# EAGLE design vaporsound (EAGLE 7.2.0)
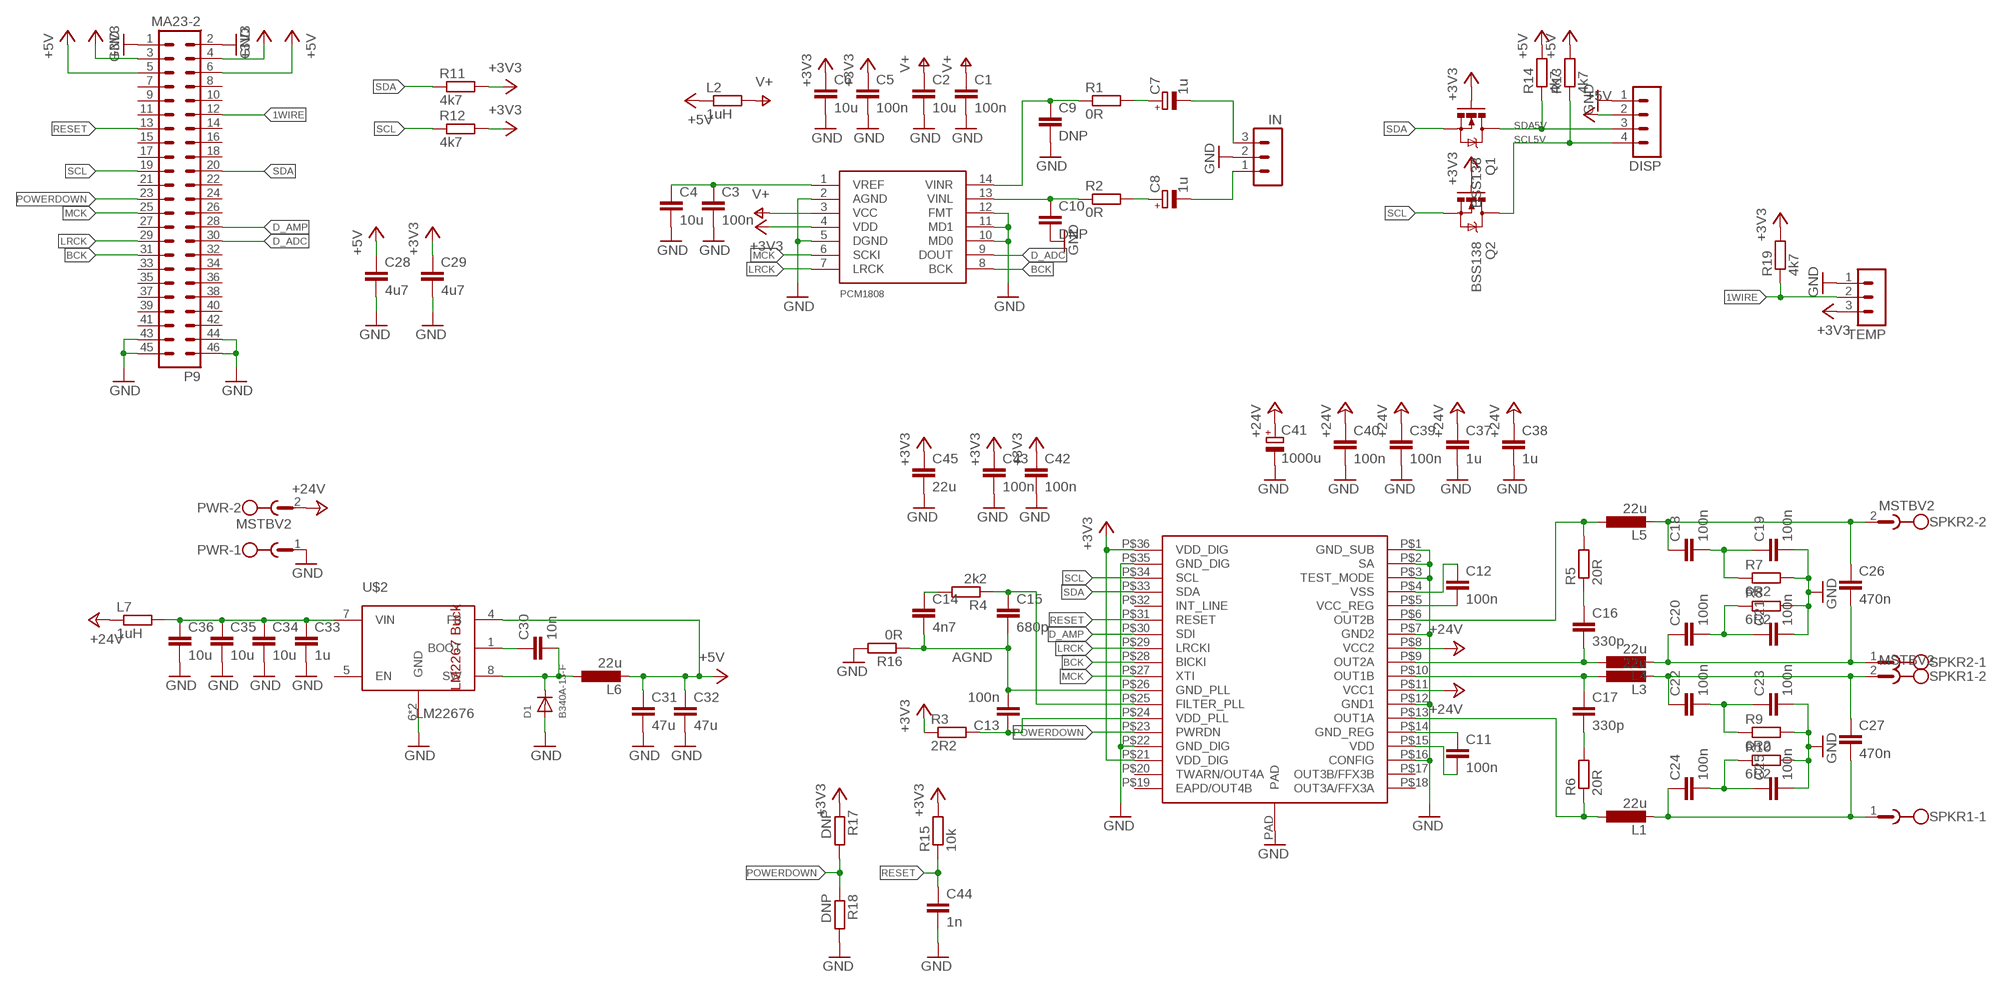
[diagram p0: schematic, sheet 1]

## Parts
C1  100n  C-EUC0603  [C0603]
C2  10u  C-EUC0805  [C0805]
C3  100n  C-EUC0603  [C0603]
C4  10u  C-EUC0805  [C0805]
C5  100n  C-EUC0603  [C0603]
C6  10u  C-EUC0805  [C0805]
C7  1u  CPOL-EUE2-5  [E2-5]
C8  1u  CPOL-EUE2-5  [E2-5]
C9  DNP  C-EUC0603  [C0603]
C10  DNP  C-EUC0603  [C0603]
C11  100n  C-EUC0603  [C0603]
C12  100n  C-EUC0603  [C0603]
C13  100n  C-EUC0603  [C0603]
C14  4n7  C-EUC0603  [C0603]
C15  680p  C-EUC0603  [C0603]
C16  330p  C-EUC0603  [C0603]
C17  330p  C-EUC0603  [C0603]
C18  100n  C-EUC0603  [C0603]
C19  100n  C-EUC0603  [C0603]
C20  100n  C-EUC0603  [C0603]
C21  100n  C-EUC0603  [C0603]
C22  100n  C-EUC0603  [C0603]
C23  100n  C-EUC0603  [C0603]
C24  100n  C-EUC0603  [C0603]
C25  100n  C-EUC0603  [C0603]
C26  470n  C-EU050-045X075  [C050-045X075]
C27  470n  C-EU050-045X075  [C050-045X075]
C28  4u7  C-EUC0805  [C0805]
C29  4u7  C-EUC0805  [C0805]
C30  10n  C-EUC0603  [C0603]
C31  47u  C-EUC1206  [C1206]
C32  47u  C-EUC1206  [C1206]
C33  1u  C-EUC0805  [C0805]
C34  10u  C-EUC1206  [C1206]
C35  10u  C-EUC1206  [C1206]
C36  10u  C-EUC1206  [C1206]
C37  1u  C-EUC1206  [C1206]
C38  1u  C-EUC1206  [C1206]
C39  100n  C-EUC0603  [C0603]
C40  100n  C-EUC0603  [C0603]
C41  1000u  CPOL-EUE5-10.5  [E5-10,5]
C42  100n  C-EUC0603  [C0603]
C43  100n  C-EUC0603  [C0603]
C44  1n  C-EUC0603  [C0603]
C45  22u  C-EUC1206  [C1206]
D1  B340A-13-F  DIODESMA  [SMADIODE]
DISP  MA04-1  [MA04-1]
IN  MA03-1  [MA03-1]
L1  22u  L-EUSRR1210  [SRR1210]
L2  1uH  R-EU_R0805  [R0805]
L3  22u  L-EUSRR1210  [SRR1210]
L4  22u  L-EUSRR1210  [SRR1210]
L5  22u  L-EUSRR1210  [SRR1210]
L6  22u  L-EUIHLP-3232DZ-11  [IHLP-3232DZ-11]
L7  1uH  R-EU_R0805  [R0805]
P9  MA23-2  [MA23-2]
PWR  MSTBV2  [MSTBV2]
Q1  BSS138  MOSFET-NCHANNELBSS138  [SOT23-3]
Q2  BSS138  MOSFET-NCHANNELBSS138  [SOT23-3]
R1  0R  R-EU_R0603  [R0603]
R2  0R  R-EU_R0603  [R0603]
R3  2R2  R-EU_R0603  [R0603]
R4  2k2  R-EU_R0603  [R0603]
R5  20R  R-EU_R1206  [R1206]
R6  20R  R-EU_R1206  [R1206]
R7  6R2  R-EU_R1206  [R1206]
R8  6R2  R-EU_R1206  [R1206]
R9  6R2  R-EU_R1206  [R1206]
R10  6R2  R-EU_R1206  [R1206]
R11  4k7  R-EU_R0603  [R0603]
R12  4k7  R-EU_R0603  [R0603]
R13  4k7  R-EU_R0603  [R0603]
R14  4k7  R-EU_R0603  [R0603]
R15  10k  R-EU_R0603  [R0603]
R16  0R  R-EU_R0603  [R0603]
R17  DNP  R-EU_R0603  [R0603]
R18  DNP  R-EU_R0603  [R0603]
R19  4k7  R-EU_R0603  [R0603]
SPKR1  MSTBV2  [MSTBV2]
SPKR2  MSTBV2  [MSTBV2]
TEMP  MA03-1  [MA03-1]
U$1  STA350BW  [POWERSSO-36]
U$2  LM22676  LM2267_123  [DDA0008B]
U$3  PCM1808  [TSSOP14]

## Nets
1WIRE: P9.12 R19.1 TEMP.2
24V_DIGITAL: C33.1 C34.1 C35.1 C36.1 L7.2 U$2.7(VIN)
+3V3: C5.1 C6.1 C29.1 C42.1 C43.1 C45.1 P9.3 P9.4 Q1.1(G) Q2.1(G) R3.1 R11.2 R12.2 R15.2 R17.1 R19.2 TEMP.3 U$1.P$21(VDD_DIG) U$1.P$36(VDD_DIG) U$3.4(VDD)
+5V: C28.1 C31.1 C32.1 DISP.2 L2.1 L6.P$2 P9.5 P9.6 R13.2 R14.2 U$2.4(FB)
+24V: C37.1 C38.1 C39.1 C40.1 C41.+ L7.1 PWR.2 U$1.P$8(VCC2) U$1.P$11(VCC1)
ADC_VREF: C3.1 C4.1 U$3.1(VREF)
AGND: C13.2 C14.2 C15.2 R16.1 U$1.P$26(GND_PLL)
BCK: P9.31 U$1.P$28(BICKI) U$3.8(BCK)
BOOST: C30.1 U$2.1(BOOT)
C_LEFT: C8.+ R2.2
C_RIGHT: C7.+ R1.2
D_ADC: P9.30 U$3.9(DOUT)
D_AMP: P9.28 U$1.P$30(SDI)
FILTER_PLL: C15.1 R4.1 U$1.P$25(FILTER_PLL)
GND: C1.2 C2.2 C3.2 C4.2 C5.2 C6.2 C9.2 C10.2 C19.2 C21.2 C23.2 C25.2 C28.2 C29.2 C31.2 C32.2 C33.2 C34.2 C35.2 C36.2 C37.2 C38.2 C39.2 C40.2 C41.- C42.2 C43.2 C44.2 C45.2 D1.A DISP.1 IN.2 P9.1 P9.2 P9.43 P9.44 P9.45 P9.46 PWR.1 R7.2 R8.2 R9.2 R10.2 R16.2 R18.2 TEMP.1 U$1.P$1(GND_SUB) U$1.P$2(SA) U$1.P$3(TEST_MODE) U$1.P$7(GND2) U$1.P$12(GND1) U$1.P$16(CONFIG) U$1.P$22(GND_DIG) U$1.P$35(GND_DIG) U$1.PAD U$2.6(GND) U$2.EPAD(GND) U$3.2(AGND) U$3.5(DGND) U$3.10(MD0) U$3.11(MD1) U$3.12(FMT)
GND_REG: C11.1 U$1.P$14(GND_REG)
LEFT_INPUT: C8.- IN.1
LRCK: P9.29 U$1.P$29(LRCKI) U$3.7(LRCK)
MCK: P9.25 U$1.P$27(XTI) U$3.6(SCKI)
N$6: C17.2 R6.2
N$11: C14.1 R4.2
N$12: C16.1 R5.1
N$19: C18.2 C19.1 R7.1
N$21: C20.2 C21.1 R8.1
N$27: C24.2 C25.1 R10.1
N$28: C22.2 C23.1 R9.1
OUT1A: L1.P$1 R6.1 U$1.P$13(OUT1A)
OUT1B: C17.1 L3.P$1 U$1.P$10(OUT1B)
OUT2A: C16.2 L4.P$1 U$1.P$9(OUT2A)
OUT2B: L5.P$1 R5.2 U$1.P$6(OUT2B)
POWERDOWN: P9.23 R17.2 R18.1 U$1.P$23(PWRDN)
RESET: C44.1 P9.13 R15.1 U$1.P$31(RESET)
RIGHT_INPUT: C7.- IN.3
SCL: P9.19 Q2.2(S) R12.1 U$1.P$34(SCL)
SCL5V: DISP.4 Q2.3(D) R13.1
SDA: P9.20 Q1.2(S) R11.1 U$1.P$33(SDA)
SDA5V: DISP.3 Q1.3(D) R14.1
SPKR1A: C24.1 C27.2 L1.P$2 SPKR1.1
SPKR1B: C22.1 C27.1 L3.P$2 SPKR1.2
SPKR2A: C20.1 C26.2 L4.P$2 SPKR2.1
SPKR2B: C18.1 C26.1 L5.P$2 SPKR2.2
SW: C30.2 D1.C L6.P$1 U$2.8(SW)
V+: C1.1 C2.1 L2.2 U$3.3(VCC)
VCC_REG: C12.2 U$1.P$5(VCC_REG)
VDD: C11.2 U$1.P$15(VDD)
VDD_PLL: C13.1 R3.2 U$1.P$24(VDD_PLL)
VIN_L: C10.1 R2.1 U$3.13(VINL)
VIN_R: C9.1 R1.1 U$3.14(VINR)
VSS: C12.1 U$1.P$4(VSS)
Unconnected: P9.7 P9.8 P9.9 P9.10 P9.11 P9.14 P9.15 P9.16 P9.17 P9.18 P9.21 P9.22 P9.24 P9.26 P9.27 P9.32 P9.33 P9.34 P9.35 P9.36 P9.37 P9.38 P9.39 P9.40 P9.41 P9.42 U$1.P$17(OUT3B/FFX3B) U$1.P$18(OUT3A/FFX3A) U$1.P$19(EAPD/OUT4B) U$1.P$20(TWARN/OUT4A) U$1.P$32(INT_LINE) U$2.5(EN)

## Library data of the parts
C1-C6 C9-C40 C42-C45 = rcl:C-EU: CAPACITOR, European symbol
C7 C8 C41 = rcl:CPOL-EU: POLARIZED CAPACITOR, European symbol
D1 = mircobuilder:DIODE: Diode SMA Model Volts Amps Type Vf Vr Digikey # Notes SSA34-E3 40V 3A Schottky 480mV @ 3A 200uA @ 40V SSA34-E3/61TGITR-ND CDBA120-G 20V 1A Schottky 500mV @ 1A 500uA @ 20V 641-1014-6-ND REEL MBRA210 10V 2A Schottky 350mV @ 2A 700uA @ 10V MBRA210LT3 SOD-123 Model Volts Amps Type Vf Vr Order # Notes BAT54T1G 30V 200mA Schottky 800mV @ 200mA 2uA @ 25V BAT54T1GOSTR-ND B0530W 30V 500mA Schottky 430mV @ 500mA 130uA @ 30V B0530W-FDICT-ND REEL MBR120 1A 20V Schottky 340mV @ 1A MBR120VLSFT1GOSCT-ND SOD-323 Model Volts Amps Type Vf Vr Order # Notes PMEG2005EJ 20V 500mA Schottky 355mV @ 500mA 568-4110-1-ND ZLLS410 10V 570mA Schottky 380mV @ 570mA ZLLS410CT-ND 1N4148WS 75V 150mA Silicon/Simple 1V 1N4148WSFSCT-ND REEL SOD-523 Model Volts Amps Type Vf Vr Order # Notes BAT54XV2 30V 200mA Schottky 0.8V @ 100mA BAT54XV2CT-ND TB751S 30V 30mA Schottky RB751S-40TE61CT-ND SOT23-R/W (R = Solder Paste/Reflow Ovens, W = Hand-Soldering) Model Volts Amps Type Vf Vr Order # Notes BAT54FILM 40V 300mA Schottky 497-7162-1-ND
DISP = con-lstb:MA04-1: PIN HEADER; OC_FARNELL: unknown; OC_NEWARK: unknown
IN TEMP = con-lstb:MA03-1: PIN HEADER; OC_FARNELL: unknown; OC_NEWARK: unknown
L1 L3-L6 = custom-ind:L-EU: INDUCTOR, European symbol
L2 L7 R1-R19 = rcl:R-EU_: RESISTOR, European symbol
P9 = con-lstb-mod:MA23-2
PWR SPKR1 SPKR2 = con-phoenix-508:MSTBV2: PHOENIX; MPN: MSTBV 2,5/2-GF-5.08; OC_FARNELL: 1792792; OC_NEWARK: 69R9845
Q1 Q2 = SparkFun-DiscreteSemi:MOSFET-NCHANNEL: Common NMOSFET Parts MFG P/N Store ID Prod ID FDD8780 TRANS-09984 SI7820DN TRANS-11055 FDS6630A IC-08089 2N7002PW TRANS-11151 FQP30N06L COM-10213 TRANS-10060 BSS123LT1G TRANS-08345 BSS138 TRANS-00830 BS170 2N7000; PROD_ID: TRANS-00830
U$1 = sta350bw:STA350BW
U$2 = LM2267_123:LM2267_123: LM2267x X may be either the 1, 2, or 3 versions.
U$3 = pcm1808:PCM1808

## Board
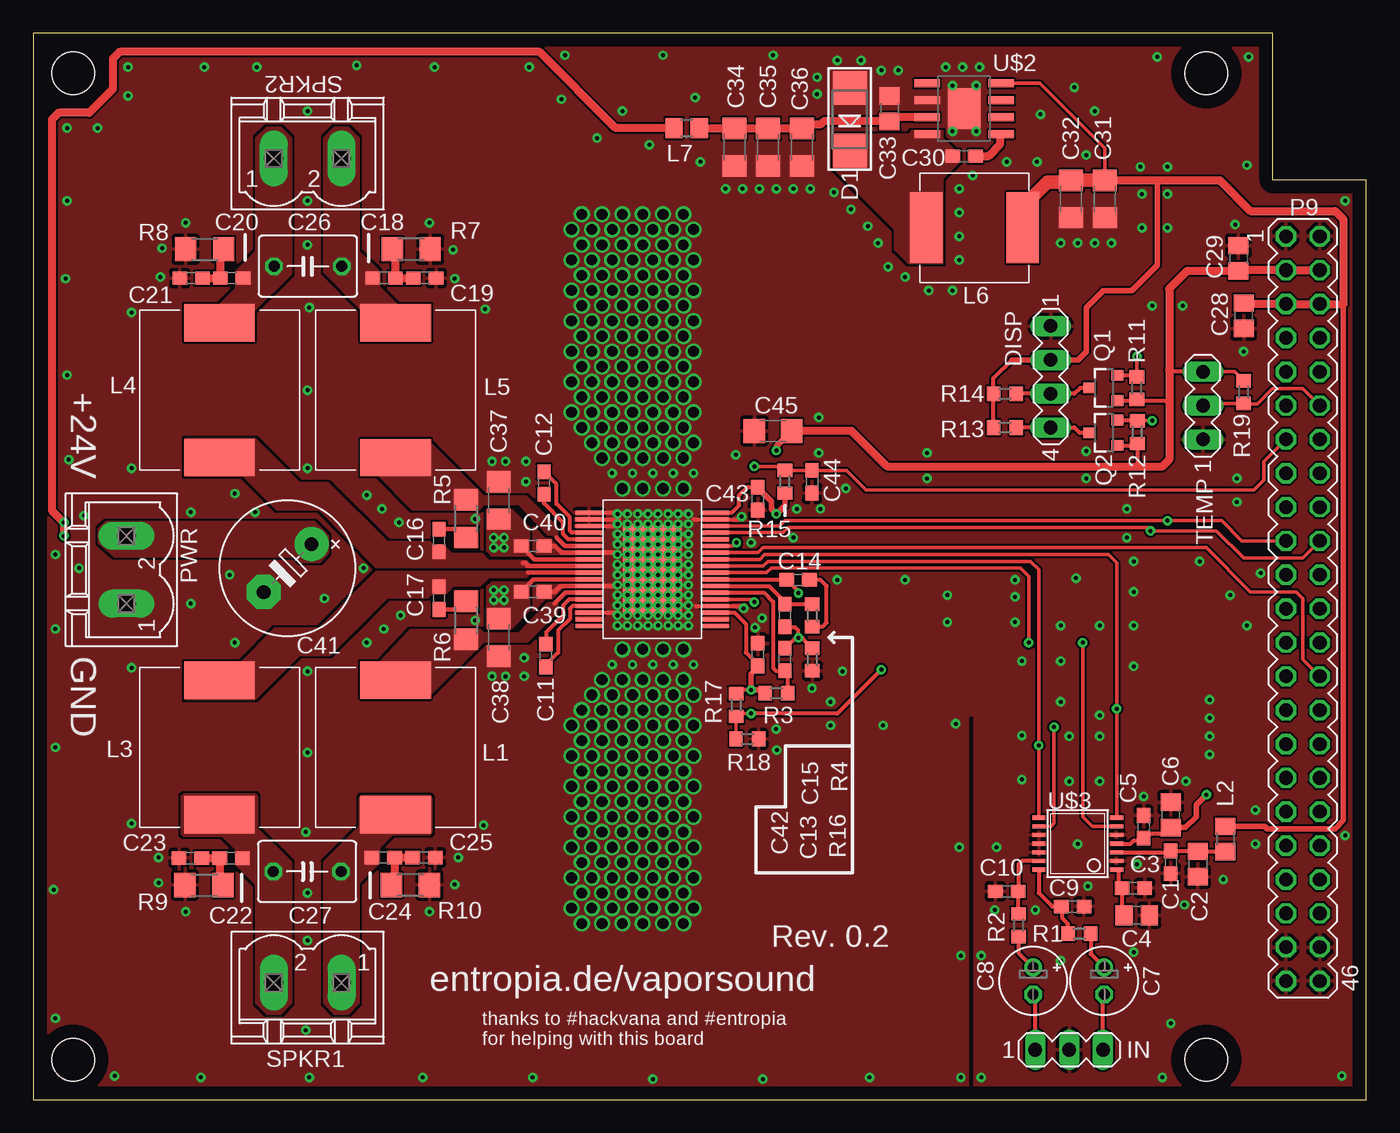
[diagram p1: board, top side]
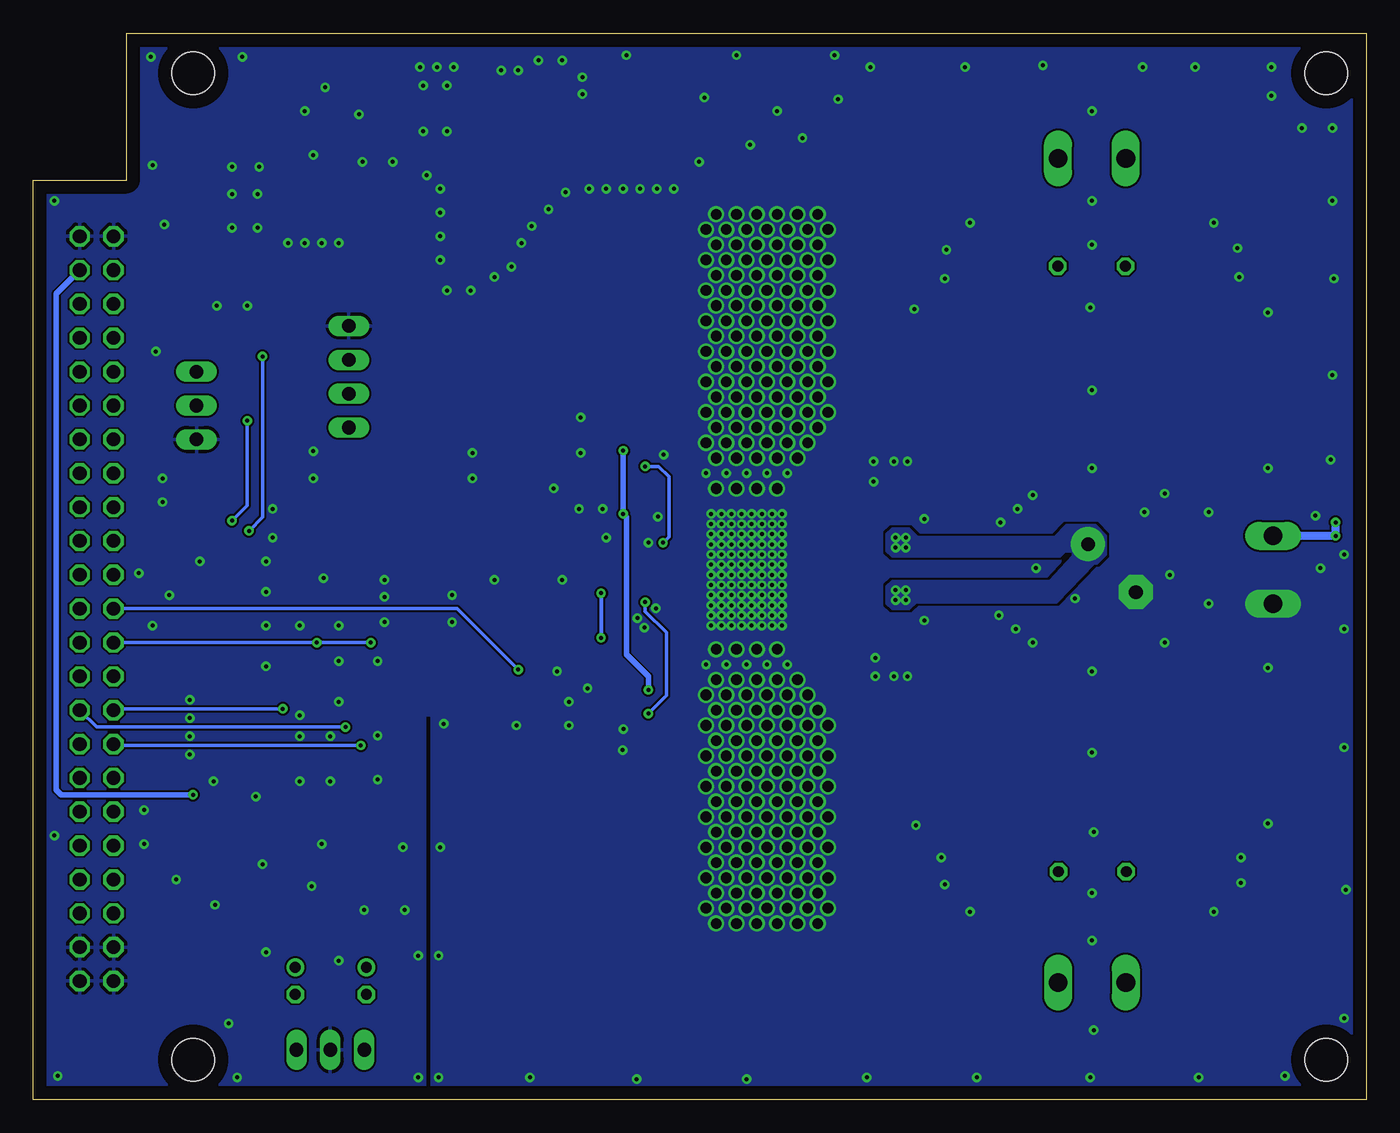
[diagram p2: board, bottom side, seen from below]

Size 100 x 80 mm. Coordinates in mm from the lower left corner, seen from the top.
Outline: 0,0 100,0 100,69 93,69 93,80 0,80 0,0
Copper layers (1*16): Top 0.035mm / dielectric 1.5mm / Bottom 0.035mm
Design rules "default *": minimum track width 8mil, minimum drill 0.3mm, track to track 6mil, track to pad 6mil, pad to pad 6mil, via to via 6mil, smd to smd 6mil, copper to edge 40mil, drill to drill 8mil, minimum pad ring 10mil, minimum via ring 8mil, stop-mask expansion 4mil, vias tented up to drill 0mil, thermal gap 10mil
Holes 3.2 mm at 3,77 3,3 88,3 88,77

### Footprints (pad centres in the part's own frame; a part is rotated, then mirrored left to right if it is on the bottom)
C0603 = smd 1.1 x 1: 1 -0.85,0; 2 0.85,0
C0805 = smd 1.3 x 1.5: 1 -0.95,0; 2 0.95,0
E2-5 = drill 0.813 pad 1.27: + -1.016,0 | drill 0.813 pad 1.27 octagon: - 1.016,0
C050-045X075 = drill 0.813 octagon: 1 -2.54,0; 2 2.54,0
C1206 = smd 1.6 x 1.8: 1 -1.4,0; 2 1.4,0
E5-10,5 = drill 1.016 pad 2.54: + -2.54,0 | drill 1.016 pad 2.54 octagon: - 2.54,0
SMADIODE = smd 2.54 x 2.54: A 2.349,0; C -2.349,0
MA04-1 = drill 1.016 long: 1 -3.81,0; 2 -1.27,0; 3 1.27,0; 4 3.81,0
MA03-1 = drill 1.016 long: 1 -2.54,0; 2 0,0; 3 2.54,0
SRR1210 = smd 5.3 x 2.8: P$1 0,5.05; P$2 0,-5.05
R0805 = smd 1.3 x 1.5: 1 -0.95,0; 2 0.95,0
IHLP-3232DZ-11 = smd 5.334 x 2.413: P$1 0,3.619; P$2 0,-3.619
MA23-2 = drill 1.016 octagon: 1 0,0; 2 0,2.54; 3 2.54,0; 4 2.54,2.54; 5 5.08,0; 6 5.08,2.54; 7 7.62,0; 8 7.62,2.54; 9 10.16,0; 10 10.16,2.54; 11 12.7,0; 12 12.7,2.54; 13 15.24,0; 14 15.24,2.54; 15 17.78,0; 16 17.78,2.54; 17 20.32,0; 18 20.32,2.54; 19 22.86,0; 20 22.86,2.54; 21 25.4,0; 22 25.4,2.54; 23 27.94,0; 24 27.94,2.54; 25 30.48,0; 26 30.48,2.54; 27 33.02,0; 28 33.02,2.54; 29 35.56,0; 30 35.56,2.54; 31 38.1,0; 32 38.1,2.54; 33 40.64,0; 34 40.64,2.54; 35 43.18,0; 36 43.18,2.54; 37 45.72,0; 38 45.72,2.54; 39 48.26,0; 40 48.26,2.54; 41 50.8,0; 42 50.8,2.54; 43 53.34,0; 44 53.34,2.54; 45 55.88,0; 46 55.88,2.54
MSTBV2 = drill 1.397 long: 1 -2.54,0; 2 2.54,0
SOT23-3 = smd 0.8 x 0.9: 1 -0.95,-1; 2 0.95,-1; 3 0,1.1
R0603 = smd 1 x 1.1: 1 -0.85,0; 2 0.85,0
R1206 = smd 1.6 x 1.803: 1 -1.422,0; 2 1.422,0
POWERSSO-36 = smd 2 x 0.318: P$1 -4.75,4.25; P$2 -4.75,3.75; P$3 -4.75,3.25; P$4 -4.75,2.75; P$5 -4.75,2.25; P$6 -4.75,1.75; P$7 -4.75,1.25; P$8 -4.75,0.75; P$9 -4.75,0.25; P$10 -4.75,-0.25; P$11 -4.75,-0.75; P$12 -4.75,-1.25; P$13 -4.75,-1.75; P$14 -4.75,-2.25; P$15 -4.75,-2.75; P$16 -4.75,-3.25; P$17 -4.75,-3.75; P$18 -4.75,-4.25; P$19 4.75,-4.25; P$20 4.75,-3.75; P$21 4.75,-3.25; P$22 4.75,-2.75; P$23 4.75,-2.25; P$24 4.75,-1.75; P$25 4.75,-1.25; P$26 4.75,-0.75; P$27 4.75,-0.25; P$28 4.75,0.25; P$29 4.75,0.75; P$30 4.75,1.25; P$31 4.75,1.75; P$32 4.75,2.25; P$33 4.75,2.75; P$34 4.75,3.25; P$35 4.75,3.75; P$36 4.75,4.25 | smd 4.4 x 6.8: PAD 0,0
DDA0008B = smd 1.91 x 0.61: 1 -2.78,1.905; 2 -2.78,0.635; 3 -2.78,-0.635; 4 -2.78,-1.905; 5 2.78,-1.905; 6 2.78,-0.635; 7 2.78,0.635; 8 2.78,1.905 | smd 2.41 x 3.1: EPAD 0,0
TSSOP14 = smd 0.305 x 0.991: 1 -1.95,-2.918; 2 -1.3,-2.918; 3 -0.65,-2.918; 4 0,-2.918; 5 0.65,-2.918; 6 1.3,-2.918; 7 1.95,-2.918; 8 1.95,2.918; 9 1.3,2.918; 10 0.65,2.918; 11 0,2.918; 12 -0.65,2.918; 13 -1.3,2.918; 14 -1.95,2.918

### Placement (x,y rotation side)
C1  85.34,17.8 270 top
C2  87.37,17.68 270 top
C3  82.53,15.87 0 top
C4  82.78,13.84 0 top
C5  83.3,20.47 90 top
C6  85.34,21.36 90 top
C7  80.35,8.9 270 top
C8  75.01,8.9 270 top
C9  77.98,14.48 0 top
C10  73.03,15.62 180 top
C11  38.44,33.3 270 top
C12  38.31,46.26 270 top
C13  56.39,33.02 90 top
C14  57.38,38.99 180 top
C15  56.39,36.32 270 top
C16  30.44,41.94 270 top
C17  30.44,37.62 270 top
C18  26.32,61.64 0 top
C19  29.37,61.64 0 top
C20  14.89,61.64 180 top
C21  11.84,61.64 180 top
C22  14.83,18.12 180 top
C23  11.78,18.12 180 top
C24  26.26,18.16 0 top
C25  29.31,18.16 0 top
C26  20.6,62.52 180 top
C27  20.55,17.1 0 top
C28  90.81,58.8 270 top
C29  90.42,63.12 90 top
C30  69.83,70.79 180 top
C31  80.39,67.56 270 top
C32  77.85,67.56 270 top
C33  64.25,74.34 90 top
C34  52.59,71.45 270 top
C35  55.13,71.45 270 top
C36  57.67,71.45 270 top
C37  34.92,44.96 90 top
C38  34.92,34.67 270 top
C39  37.47,38.1 0 top
C40  37.47,41.53 0 top
C41  19.08,39.87 225 top
C42  54.36,33.38 90 top
C43  54.36,45.09 270 top
C44  58.42,46.35 270 top
C45  55.5,50.16 180 top
D1  61.26,73.55 90 top
DISP  76.33,54.23 270 top
IN  77.72,3.73 0 top
L1  27.18,26.42 0 top
L2  89.43,19.55 270 top
L3  13.97,26.42 0 top
L4  13.97,53.21 180 top
L5  27.18,53.21 180 top
L6  70.61,65.41 90 top
L7  49.02,72.9 0 top
P9  93.98,64.77 270 top
PWR  6.99,39.75 90 top
Q1  80.33,53.4 90 top
Q2  80.33,50.03 90 top
R1  78.49,12.45 0 top
R2  73.91,13.08 270 top
R3  55.75,30.48 0 top
R4  58.45,36.32 270 top
R5  32.47,43.59 90 top
R6  32.47,35.97 90 top
R7  28.35,63.8 0 top
R8  12.86,63.8 180 top
R9  12.8,16.09 180 top
R10  28.29,16.09 0 top
R11  82.79,53.38 270 top
R12  82.83,50.08 270 top
R13  72.9,50.42 180 top
R14  72.9,52.96 180 top
R15  56.39,46.35 270 top
R16  58.45,33.02 270 top
R17  52.73,29.59 270 top
R18  53.57,27.05 0 top
R19  90.81,53.09 90 top
SPKR1  20.57,8.76 180 top
SPKR2  20.57,70.61 0 top
TEMP  87.76,52.07 90 top
U$1  46.44,39.78 0 top
U$2  69.83,74.34 180 top
U$3  78.35,19.2 90 top

### Tracks (layer width: path | path; a pad name or v marks a point on that pad's centre or on a via)
1WIRE
  Top 0.254: P9.12 95.25,53.34 92.96,53.34 91.82,52.2 90.84,52.2 R19.1 87.92,52.24 TEMP.2
24V_DIGITAL
  Top 0.61: U$2.7 64.56,73.71 C33.1 59.3,73.39 59.05,73.15 57.97,73.15 C36.1 C35.1 C34.1 52.55,72.9 L7.2
+3V3  (via drill 0.3)
  Top 0.254: TEMP.3 90.13,54.61 R19.2 | 85.08,52.45 85.1,52.45 85.22,52.32 | 52.77,30.73 52.73,30.73 R17.1
  Top 0.305: U$3.4 82.32,19.2 82.55,19.43 83.12,19.43 C5.1 83.62,19.94 84.71,19.94 84.84,20.07 84.96,20.07 85.31,20.41 C6.1 | Q2.1 82.68,49.08 R12.2 82.83,47.52 82.8,47.5 | Q1.1 82.71,52.45 | 82.71,52.45 R11.2 | U$1.P$36 52.41,44.03 52.96,44.58 52.96,45.34 53.59,45.97 54.32,45.97 C43.1 | v53.85,30.73 52.77,30.73 | U$1.P$21 52.62,36.53 53.47,35.69 53.47,33.53 54.36,32.64 C42.1 | 82.71,52.45 85.08,52.45 | TEMP.3 85.34,54.61 85.22,54.74
  Top 0.406: R15.2 56.39,44.58 v55.75,43.94 55.37,44.32 55.37,44.86 54.36,45.87 C43.1 | R3.1 54.65,30.73 v53.85,30.73 53.85,31.92 54.36,32.42 C42.1 | C6.1 86.45,20.41 87.25,21.21 87.25,22.1 v88.01,22.86 | v55.75,48.69 55.75,49.02 C45.1
  Top 0.61: P9.4 P9.3 90.48,62.23 C29.1 86.55,62.17 85.22,60.83 85.22,54.74 85.22,52.32 85.22,48.01 84.71,47.5 82.8,47.5 64.06,47.5 61.39,50.16 C45.1
  Bottom 0.406: v53.85,30.73 53.85,31.75 55.5,33.4 55.5,43.69 v55.75,43.94 v55.75,48.69 | v88.01,22.86 97.92,22.86 98.3,23.24 98.3,60.45 P9.4
+5V
  Top 0.254: U$2.4 75.52,76.25 80.39,71.37 C31.1
  Top 0.305: R13.2 R14.2 72.01,53 72.01,54.1 73.41,55.5
  Top 0.406: 84.33,68.96 84.33,62.61 82.42,60.71 80.26,60.71 78.99,59.44 78.99,56.13 78.36,55.5 DISP.2 73.41,55.5 | L2.1 92.4,20.5 92.58,20.32 97.66,20.32 98.3,20.95 98.3,60.07
  Top 0.61: C28.1 90.87,59.69 P9.5 P9.6 98.3,59.69 98.3,60.07 98.3,66.04 97.66,66.67 91.31,66.67 89.02,68.96 84.33,68.96 C31.1
  Top 0.813: 74.22,66.98 74.23,66.98 L6.P$2
  Top 1.016: 74.22,66.98 76.07,68.83 77.72,68.83 C32.1 C31.1
+24V  (via drill 0.3, 0.3 pad 0.3)
  Top 0.33: U$1.P$11 37.55,39.03 C39.1 | U$1.P$8 37.61,40.53 C40.1
  Top 0.61: L7.1 43.69,72.9 37.97,78.61 6.48,78.61 5.97,78.11 5.97,75.82 4.19,74.04 1.91,74.04 1.4,73.53 1.4,44.2 v2.29,43.31 v2.29,42.29
  Bottom 0.61: PWR.2 v2.29,42.29 v2.29,43.31
  other vias: 34.54,42.16 35.31,42.16 34.54,41.4 35.31,41.4 35.31,37.47 34.54,37.47 34.54,38.23 35.31,38.23
  pour Top (no thermals): 34.04,35.43 35.94,35.43 37.21,36.7 37.21,38.73 37.13,38.81 34.37,38.81 34.04,38.48
  pour Top (no thermals): 34.04,44.2 35.94,44.2 37.21,42.93 37.21,40.82 34.37,40.82 34.04,41.15
  pour Bottom (no thermals): 34.29,42.8 35.56,42.8 35.94,42.42 35.94,41.15 35.56,40.77 22.99,40.77 22.61,41.15 21.97,41.15 21.97,40.77 23.75,38.86 35.56,38.86 35.94,38.48 35.94,37.21 35.56,36.83 34.29,36.83 33.78,37.34 23.24,37.34 20.45,40.26 20.19,40.26 19.56,40.89 19.56,42.29 20.32,43.05 22.48,43.05 23.37,42.16 33.66,42.16
  pour Top (no thermals): 5.46,43.31 21.08,43.31 22.1,42.29 22.1,41.02 21.46,40.39 20.07,40.39 19.68,40.77 6.1,40.77 4.95,41.78 4.95,42.8
ADC_VREF
  Top 0.305: U$3.1 81.38,17.25 81.41,17.27 81.41,16.14 C3.1 81.68,13.99 C4.1
AGND  (via drill 0.3)
  Top 0.305: v57.4,34.65 57.4,35.18 57.15,35.43 56.43,35.43 C15.2 | v57.4,34.65 57.16,34.65 C13.2 | U$1.P$26 56.49,39.03 C14.2 57.4,38.11 v57.4,38 | v57.4,34.65 57.67,34.65 R16.1
  Bottom 0.305: v57.4,38 v57.4,34.65
BCK  (via drill 0.3)
  Top 0.254: U$1.P$28 54.76,40.03 55.12,40.39 74.8,40.39 75.44,39.75 v75.44,26.57 U$3.8
  Bottom 0.254: v75.44,26.57 93.88,26.57 P9.31
BOOST
  Top 0.61: U$2.1 72.52,72.44 72.52,71.63 71.67,70.79 C30.1
C_LEFT
  Top 0.305: R2.2 73.91,11.01 C8.+
C_RIGHT
  Top 0.305: R1.2 79.34,10.93 C7.+
D_ADC  (via drill 0.3)
  Top 0.254: U$3.9 76.38,20.5 76.58,20.7 v76.58,27.94
  Bottom 0.254: v76.58,27.94 95.25,27.94 P9.30
D_AMP
  Top 0.254: U$1.P$30 54.37,41.03 54.74,41.4 88.01,41.4 91.31,38.1 94.74,38.1 95.25,37.59 95.25,33.02 P9.28
FILTER_PLL
  Top 0.305: U$1.P$25 55.2,38.53 56.39,37.34 C15.1 R4.1
GND  (via drill 0.3, 0.8)
  Top 0.305: 43.68,41.03 43.69,41.02 | U$1.P$3 43.79,43.03 43.81,43.05 | U$1.P$2 43.91,43.53 43.94,43.56 | U$1.P$1 43.78,44.03 43.81,44.07 | 43.77,38.53 43.81,38.48 | U$1.P$16 43.64,36.53 43.69,36.58 | 39.12,41.53 39.62,41.03 | 53.01,37.03 U$1.P$22 49.71,37.03 | v53.14,43.74 52.93,43.53 U$1.P$35 49.56,43.53
  Top 0.33: 43.68,41.03 U$1.P$7 39.62,41.03 | 43.77,38.53 U$1.P$12 39.55,38.53 39.12,38.1
  Top 0.343: C39.2 39.12,38.1 | C40.2 39.12,41.53
  other vias: 58.29,68.33 57.02,68.33 54.48,68.33 51.94,68.33 63.63,77.22 64.9,77.22 68.45,77.47 78.99,70.87 77.09,64.26 78.36,64.26 79.63,64.26 80.9,64.26 53.21,68.33 55.75,68.33 69.47,68.33 70.48,69.34 75.56,73.91 69.72,77.47 62.1,77.98 60.33,77.98 58.8,76.71 58.8,75.44 78.11,75.95 79.63,74.17 70.99,77.47 68.96,76.07 70.74,76.07 68.96,72.64 70.74,72.64 60.07,68.07 62.61,65.53 63.37,64.26 67.18,60.71 69.47,66.55 69.47,62.99 61.34,66.8 64.14,62.48 65.41,61.72 69.47,64.77 75.31,70.36 73.03,70.36 68.96,60.71 33.15,43.56 33.15,35.94 27.56,36.32 27.43,43.31 25.02,34.29 25.02,45.34 16.64,44.07 21.84,37.59 34.42,47.88 35.43,47.88 34.42,31.75 35.43,31.75 36.96,46.35 36.83,33.15 46.1,40.13 46.1,39.37 46.86,40.13 46.86,39.37 47.62,40.13 48.39,40.13 49.15,40.13 45.34,40.13 44.58,40.13 43.81,40.13 43.81,40.89 43.81,41.66 43.81,42.42 43.81,43.18 43.81,43.94 44.58,43.94 45.34,43.94 43.81,39.37 43.81,38.61 43.81,37.85 43.81,37.08 43.81,36.32 43.81,35.56 44.58,35.56 45.34,35.56 46.1,35.56 46.86,35.56 47.62,35.56 48.39,35.56 49.15,35.56 49.15,36.32 49.15,37.08 49.15,37.85 49.15,38.61 49.15,39.37 44.58,39.37 45.34,39.37 47.62,39.37 48.39,39.37 46.1,43.94 46.86,43.94 47.62,43.94 48.39,43.94 49.15,43.94 49.15,43.18 49.15,42.42 49.15,41.66 49.15,40.89 48.39,40.89 48.39,41.66 48.39,42.42 48.39,43.18 47.62,43.18 46.86,43.18 46.1,43.18 45.34,43.18 44.58,43.18 44.58,42.42 45.34,42.42 46.1,42.42 46.86,42.42 47.62,42.42 44.58,41.66 44.58,40.89 44.58,38.61 44.58,37.85 44.58,37.08 44.58,36.32 45.34,36.32 46.1,36.32 46.86,36.32 47.62,36.32 48.39,36.32 48.39,37.08 48.39,37.85 48.39,38.61 45.34,40.89 46.1,40.89 46.86,40.89 47.62,40.89 47.62,41.66 46.86,41.66 46.1,41.66 45.34,41.66 45.34,38.61 46.1,38.61 46.86,38.61 47.62,38.61 47.62,37.85 47.62,37.08 45.34,37.85 45.34,37.08 46.1,37.08 46.86,37.08 46.86,37.85 46.1,37.85 31.62,61.59 31.5,63.75 29.72,65.79 11.43,65.79 9.65,63.88 9.53,61.72 9.4,18.16 9.4,16.26 11.43,14.1 29.72,14.1 31.62,16.13 31.88,18.16 15.11,45.47 15.11,34.29 11.81,37.21 24.77,39.88 20.7,59.44 20.45,20.07 20.57,32.13 20.57,47.37 7.11,77.47 4.83,72.9 2.54,72.9 30.1,77.47 37.21,77.47 50.04,70.36 42.29,72.14 20.57,74.17 39.88,78.36 24.26,77.6 16.76,77.47 12.83,77.47 2.54,67.44 2.41,61.59 2.67,48.01 11.81,44.07 20.57,26.04 20.57,53.21 47.24,78.36 91.19,78.23 84.33,78.23 91.06,70.1 98.17,1.78 84.71,1.65 6.1,1.78 1.65,6.1 1.65,35.31 1.65,26.42 1.52,15.75 12.57,1.65 20.7,1.65 29.21,1.65 37.47,1.65 46.48,1.52 54.74,1.52 62.74,1.65 71.12,1.65 49.66,75.18 46.23,71.63 55.5,78.36 39.62,75.06 44.2,74.17 2.54,54.36 3.81,43.81 3.43,39.88 1.65,40.89 69.6,1.65 71.12,10.79 77.09,10.41 82.55,11.05 72.26,18.92 78.36,19.18 86.36,14.61 54.15,35.41 53.29,36.86 54.69,36.12 89.28,16.51 83.31,22.73 58.42,30.86 53.85,41.78 57.02,42.16 83.19,67.94 85.09,67.94 83.19,65.41 85.09,65.41 83.06,69.98 85.09,69.98 90.17,65.66 90.81,56.13 98.42,67.44 98.42,19.81 91.69,21.72 91.69,19.18 92.08,39.5 87.5,40.39 89.79,37.85 91.06,35.56 82.55,35.56 82.04,42.16 57.28,44.32 59.05,44.32 82.04,44.32 90.3,44.83 80.01,28.83 77.09,29.84 77.09,32.89 82.55,40.39 58.93,48.51 78.99,46.61 90.3,46.61 82.55,32.51 65.41,38.99 74.17,27.3 77.72,23.88 86.49,23.88 55.78,26.21 63.75,28.07 60.71,32.13 74.17,32.89 73.66,38.99 78.23,39.12 82.55,38.1 80.01,35.56 77.09,35.56 80.01,23.88 88.27,28.63 88.27,27.25 80.01,27.25 77.72,27.25 74.17,24 52.7,48.39 79.12,16 72.14,14.22 82.8,17.65 75.18,14.22 85.34,5.71 7.11,75.31 20.45,5.21 69.6,10.79 69.47,18.92 69.22,28.19 60.33,38.99 68.58,35.81 68.58,37.85 73.66,37.72 73.66,35.81 59.82,29.84 59.82,28.07 88.27,25.88 88.27,30 58.93,51.18 78.99,48.64 20.57,67.44 20.57,11.94 60.96,45.85 67.06,48.51 67.06,46.61 44.2,45.85 45.72,45.85 47.24,45.85 48.77,45.85 44.2,33.78 45.72,33.78 47.24,33.78 48.77,33.78 44.96,46.99 46.48,46.99 48.01,46.99 49.53,46.99 43.43,46.99 44.96,32.64 46.48,32.64 48.01,32.64 49.53,32.64 43.43,32.64 48.77,31.5 47.24,31.5 45.72,31.5 44.2,31.5 44.2,48.13 48.77,48.13 47.24,48.13 45.72,48.13 44.96,49.28 46.48,49.28 48.01,49.28 49.53,49.28 43.43,49.28 44.2,50.42 48.77,50.42 47.24,50.42 45.72,50.42 44.96,30.35 46.48,30.35 48.01,30.35 49.53,30.35 43.43,30.35 48.77,29.21 47.24,29.21 45.72,29.21 44.2,29.21 55.73,27.79 44.96,28.07 46.48,28.07 48.01,28.07 49.53,28.07 43.43,28.07 48.77,26.92 47.24,26.92 45.72,26.92 44.2,26.92 44.96,25.78 46.48,25.78 48.01,25.78 49.53,25.78 43.43,25.78 48.77,24.64 47.24,24.64 45.72,24.64 44.2,24.64 44.96,51.56 46.48,51.56 48.01,51.56 49.53,51.56 43.43,51.56 44.2,52.7 48.77,52.7 47.24,52.7 45.72,52.7 44.96,53.85 46.48,53.85 48.01,53.85 49.53,53.85 43.43,53.85 44.2,54.99 48.77,54.99 47.24,54.99 45.72,54.99 44.96,56.13 46.48,56.13 48.01,56.13 49.53,56.13 43.43,56.13 44.2,57.28 48.77,57.28 47.24,57.28 45.72,57.28 44.96,58.42 46.48,58.42 48.01,58.42 49.53,58.42 43.43,58.42 44.2,59.56 48.77,59.56 47.24,59.56 45.72,59.56 44.96,60.71 46.48,60.71 48.01,60.71 49.53,60.71 43.43,60.71 44.2,61.85 48.77,61.85 47.24,61.85 45.72,61.85 44.96,23.5 46.48,23.5 48.01,23.5 49.53,23.5 43.43,23.5 48.77,22.35 47.24,22.35 45.72,22.35 44.2,22.35 44.96,21.21 46.48,21.21 48.01,21.21 49.53,21.21 43.43,21.21 48.77,20.07 47.24,20.07 45.72,20.07 44.2,20.07 44.96,18.92 46.48,18.92 48.01,18.92 49.53,18.92 43.43,18.92 48.77,17.78 47.24,17.78 45.72,17.78 44.2,17.78 42.67,31.5 41.91,30.35 42.67,29.21 41.91,28.07 42.67,26.92 41.91,25.78 42.67,24.64 41.91,23.5 42.67,22.35 41.91,21.21 42.67,20.07 41.91,18.92 42.67,17.78 42.67,48.13 41.91,49.28 42.67,50.42 41.91,51.56 42.67,52.7 41.91,53.85 42.67,54.99 41.91,56.13 42.67,57.28 41.91,58.42 42.67,59.56 41.91,60.71 42.67,61.85 44.96,62.99 46.48,62.99 48.01,62.99 49.53,62.99 43.43,62.99 44.2,64.14 48.77,64.14 47.24,64.14 45.72,64.14 44.96,65.28 46.48,65.28 48.01,65.28 49.53,65.28 43.43,65.28 44.2,66.42 48.77,66.42 47.24,66.42 45.72,66.42 41.91,62.99 42.67,64.14 41.91,65.28 42.67,66.42 41.15,50.42 40.39,51.56 41.15,52.7 40.39,53.85 41.15,54.99 40.39,56.13 41.15,57.28 40.39,58.42 41.15,59.56 40.39,60.71 41.15,61.85 40.39,62.99 41.15,64.14 40.39,65.28 41.15,66.42 44.96,16.64 46.48,16.64 48.01,16.64 49.53,16.64 43.43,16.64 48.77,15.49 47.24,15.49 45.72,15.49 44.2,15.49 44.96,14.35 46.48,14.35 48.01,14.35 49.53,14.35 43.43,14.35 48.77,13.21 47.24,13.21 45.72,13.21 44.2,13.21 41.91,16.64 42.67,15.49 41.91,14.35 42.67,13.21 40.39,16.64 41.15,15.49 40.39,14.35 41.15,13.21 41.15,29.21 40.39,28.07 41.15,26.92 40.39,25.78 41.15,24.64 40.39,23.5 41.15,22.35 40.39,21.21 41.15,20.07 40.39,18.92 41.15,17.78 7.37,59.05 7.37,47.37 33.91,59.31 7.37,32.38 7.37,20.7 33.78,20.57 20.57,15.49 20.57,64.14 14.73,39.37 36.96,47.88 36.83,31.75 26.29,35.31 26.16,44.32 83.95,59.56 86.23,59.56
  pour Top (rank 5): -1.27,81.28 101.6,81.28 101.6,-1.27 70.61,-1.27 70.61,28.83 70.1,28.83 70.1,-1.27 -1.27,-1.27
  pour Top (rank 2, no thermals): 81.66,59.18 51.05,58.93 51.05,79.5 81.66,79.5
  pour Bottom (rank 5): -1.27,81.28 101.6,81.28 101.6,-1.27 70.61,-1.27 70.61,28.83 70.1,28.83 70.1,-1.27 -1.27,-1.27
  pour Top (no thermals): 15.62,39.75 19.05,39.75 19.05,36.32 15.62,36.32
  pour Bottom (no thermals): 15.62,39.75 19.05,39.75 19.05,36.32 15.62,36.32
  pour Top (rank 4, no thermals): 40.39,41.78 44.07,41.78 44.07,37.47 40.01,37.47 40.01,30.61 31.11,30.61 31.11,49.02 40.39,49.02
  pour Bottom (no thermals): 39.75,75.95 45.09,75.95 45.09,66.17 39.75,66.17
  pour Bottom (no thermals): 4.19,38.86 9.65,38.86 9.65,35.43 4.19,35.43
  pour Top (no thermals): 4.19,38.86 9.65,38.86 9.65,35.43 4.19,35.43
GND_REG
  Top 0.305: U$1.P$14 40.2,37.53 39.75,37.08 39.75,36.32 38.48,35.05 38.48,34.19 C11.1
LEFT_INPUT
  Top 0.305: IN.1 75.18,7.72 C8.-
LRCK  (via drill 0.3)
  Top 0.254: U$1.P$29 54.5,40.53 54.86,40.89 80.64,40.89 81.28,40.26 v81.28,29.31 U$3.7
  Bottom 0.254: v81.28,29.31 93.88,29.31 P9.29
MCK  (via drill 0.3)
  Top 0.254: U$1.P$27 55.02,39.53 55.37,39.88 74.04,39.88 74.68,39.24 v74.68,34.29 | U$3.6 79.45,20.5 78.74,21.21 v78.74,34.29
  Bottom 0.254: v74.68,34.29 v78.74,34.29 P9.25
N$6
  Top 0.343: C17.2 31.85,36.77 R6.2
N$11
  Top 0.305: 58.61,35.47 R4.2 59.2,35.47 59.51,35.79 59.51,38.53 59.05,38.99 C14.1
N$12
  Top 0.343: C16.1 31.85,42.79 R5.1
N$19
  Top 0.61: C19.1 C18.2 27.17,63.55 R7.1
N$21
  Top 0.61: C21.1 C20.2 14.04,63.55 R8.1
N$27
  Top 0.61: C25.1 C24.2 27.11,16.33 R10.1
N$28
  Top 0.61: C23.1 C22.2 13.98,16.33 R9.1
OUT1A
  Top 0.33: U$1.P$13 39.94,38.03 39.12,37.21
  pour Top (no thermals): 24.64,30.23 29.59,30.23 33.78,34.42 37.08,34.42 39.24,36.58 39.24,37.21 38.61,37.21 36.45,34.92 33.78,34.92 33.53,35.18 28.32,35.18 26.04,32.77 24.64,32.77
OUT1B
  Top 0.33: U$1.P$10 37.12,39.53
  pour Top (no thermals): 25.7,39.55 37.21,39.55 37.21,39.5 36.96,39.24 34.16,39.24 33.53,38.61 31.5,38.61 30.99,38.1 29.97,38.1 29.59,37.72 26.54,37.72 22.23,33.4 19.94,33.4 16.64,30.1 11.43,30.1 11.43,32.77 15.62,32.77 18.16,35.31 21.46,35.31
OUT2A
  Top 0.33: U$1.P$9 37.06,40.03 37.06,40.16 36.96,40.26 36.7,40.26
  pour Top (no thermals): 11.43,49.53 16.64,49.53 19.94,46.23 22.1,46.23 26.54,41.78 29.72,41.78 29.97,41.53 30.73,41.53 31.37,40.89 33.66,40.89 34.16,40.39 36.96,40.39 37.21,40.13 37.21,40.01 25.73,40.01 21.46,44.32 18.29,44.32 15.75,46.86 11.43,46.86
OUT2B
  Top 0.33: U$1.P$6 39.88,41.53 39.24,42.16
  pour Top (no thermals): 24.77,49.4 29.59,49.4 33.78,45.21 36.96,45.21 39.24,42.93 39.24,42.16 38.99,42.42 38.61,42.42 36.45,44.7 33.78,44.7 33.4,44.32 28.45,44.32 25.78,46.99 24.77,46.99
POWERDOWN  (via drill 0.3)
  Top 0.254: U$1.P$23 53.88,37.53 v54.1,37.31 | R18.1 R17.2 52.73,28.96 v53.85,28.96
  Top 0.305: v53.85,28.96 60.33,28.96 v63.63,32.26
  Bottom 0.254: v54.1,37.31 54.1,36.63 52.5,35.03 52.5,30.3 v53.85,28.96 | P9.23 68.2,36.83 v63.63,32.26
RESET  (via drill 0.3)
  Top 0.254: U$1.P$31 52.5,41.53 v52.76,41.78 | P9.13 92.33,47.88 92.33,46.48 91.57,45.72 62.48,45.72 61,47.2 C44.1 R15.1 56.09,47.5 v54.1,47.5
  Bottom 0.254: v52.76,41.78 52.32,42.22 52.32,46.74 53.09,47.5 v54.1,47.5
RIGHT_INPUT
  Top 0.305: IN.3 80.26,7.8 C7.-
SCL  (via drill 0.3)
  Top 0.254: U$1.P$34 55.98,43.03 56.39,43.43 v85.09,43.43 89.15,43.43 90.68,41.91 P9.19 | v83.95,50.93 R12.1
  Top 0.305: Q2.2 82.77,50.98 R12.1
  Bottom 0.254: v83.95,50.93 83.95,44.58 v85.09,43.43
SCL5V
  Top 0.305: R13.1 DISP.4 78.11,50.42 78.49,50.04 Q2.3
SDA  (via drill 0.3)
  Top 0.254: U$1.P$33 56.25,42.53 56.64,42.93 83.57,42.93 v83.82,42.67 88.77,42.67 90.81,40.64 95.25,40.64 P9.20 | v82.8,55.75 82.8,54.24 R11.1
  Top 0.305: Q1.2 82.67,54.34 R11.1
  Bottom 0.254: v82.8,55.75 82.8,43.69 v83.82,42.67
SDA5V
  Top 0.305: R14.1 DISP.3 78.11,52.96 78.54,53.4 Q1.3
SPKR1A
  pour Top (no thermals): 21.84,7.24 22.61,6.48 23.62,6.48 24.38,7.24 24.38,16.26 25.91,17.78 25.91,18.92 26.92,19.94 29.72,19.94 29.84,20.07 29.84,22.61 29.72,22.73 24.64,22.73 24.51,22.61 24.51,20.45 21.84,17.78
SPKR1B
  pour Top (no thermals): 19.3,7.24 19.3,17.78 16.76,20.32 16.76,22.73 16.64,22.86 11.3,22.86 11.18,22.73 11.18,19.94 11.3,19.81 14.22,19.81 15.24,18.8 15.24,17.65 16.76,16.13 16.76,7.24 17.53,6.48 18.54,6.48
SPKR2A
  pour Top (no thermals): 11.43,59.56 11.43,57.02 16.51,57.02 16.51,59.18 19.3,61.98 19.3,72.14 18.54,72.9 17.53,72.9 16.76,72.14 16.76,63.63 15.24,62.1 15.24,60.83 13.97,59.56
SPKR2B
  pour Top (no thermals): 22.61,72.9 23.62,72.9 24.38,72.14 24.38,63.63 25.91,62.1 25.91,60.96 27.3,59.56 29.72,59.56 29.72,57.02 24.64,57.02 24.64,59.31 21.84,62.1 21.84,72.14
SW
  pour Top (no thermals): 68.2,62.74 68.2,69.09 69.47,70.36 69.47,71.12 69.22,71.12 68.2,72.14 68.2,72.64 65.91,72.64 65.66,72.39 60.07,72.39 60.07,69.85 64.64,65.28 64.64,63.75 65.66,62.74
V+
  Top 0.305: U$3.3 85.23,18.55 C1.1 87.34,18.65 C2.1 89.41,18.62 L2.2
VCC_REG
  Top 0.305: U$1.P$5 40.14,42.03 39.75,42.42 39.75,43.31 38.31,44.74 C12.2
VDD
  Top 0.305: U$1.P$15 40.46,37.03 40.26,36.83 40.26,36.07 39.37,35.18 39.37,33.64 39.37,33.53 38.44,32.6 C11.2
VDD_PLL
  Top 0.305: U$1.P$24 54.81,38.03 55.5,37.34 55.5,32.38 55.71,32.17 C13.1 56.6,31.95 R3.2
VIN_L
  Top 0.305: R2.1 73.91,15.58 C10.1 73.91,15.66 73.91,17.65 74.16,17.9 U$3.13
VIN_R
  Top 0.305: R1.1 77.64,13.17 77.22,13.59 77.22,14.39 C9.1 76.45,14.48 75.43,15.5 U$3.14
VSS
  Top 0.305: U$1.P$4 40.4,42.53 40.26,42.67 40.26,43.69 39.24,44.7 39.24,46.18 C12.1

### Text on the board
tNames: +24V | GND | Rev. 0.2 | entropia.de/vaporsound | thanks to #hackvana and #entropia / for helping with this board